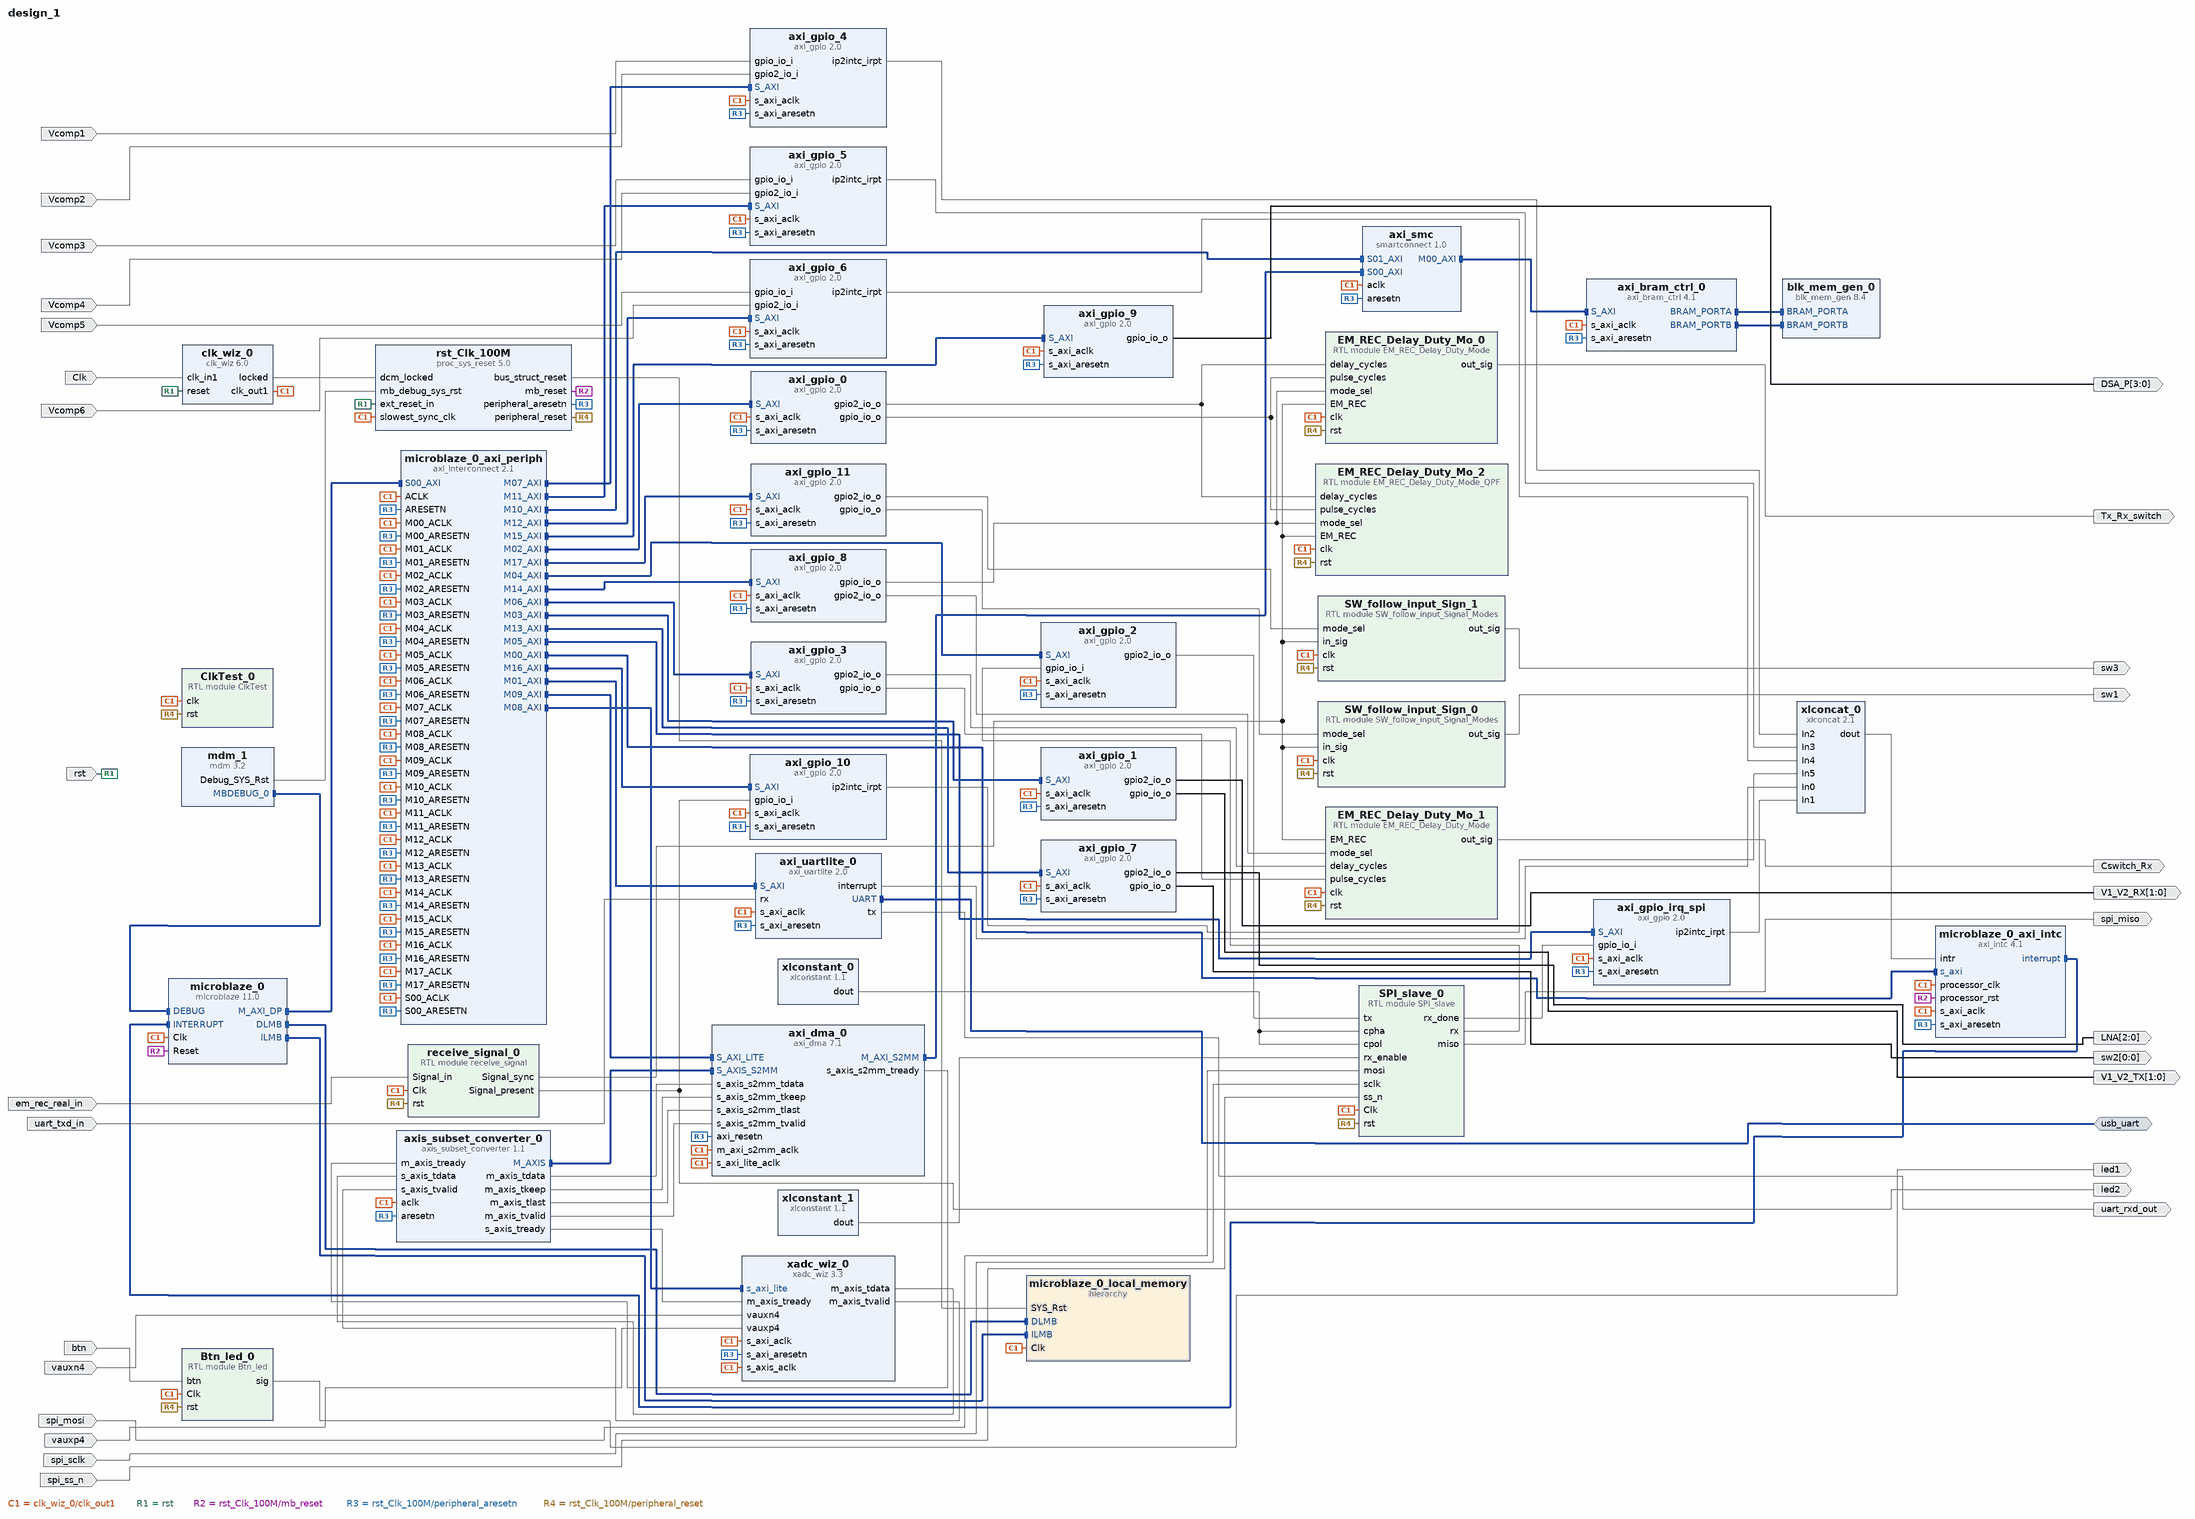
[diagram p0: block diagram of the top level]
# Vivado block design design_1, xc7a35tcpg236-1, Vivado 2025.1
create_bd_design design_1

create_bd_intf_port -mode Master -vlnv xilinx.com:interface:uart_rtl:1.0 usb_uart
create_bd_port -dir I -type clk Clk
set_property -dict {CONFIG.FREQ_HZ 12000000} [get_bd_ports Clk]
create_bd_port -dir I -type rst rst
set_property -dict {CONFIG.POLARITY ACTIVE_HIGH} [get_bd_ports rst]
create_bd_port -dir I uart_txd_in
create_bd_port -dir O uart_rxd_out
create_bd_port -dir O led1
create_bd_port -dir I spi_sclk
create_bd_port -dir I spi_mosi
create_bd_port -dir O spi_miso
create_bd_port -dir I spi_ss_n
create_bd_port -dir O Tx_Rx_switch
create_bd_port -dir O Cswitch_Rx
create_bd_port -dir I em_rec_real_in
create_bd_port -dir O -from 1 -to 0 V1_V2_TX
create_bd_port -dir I Vcomp1
create_bd_port -dir I Vcomp2
create_bd_port -dir I vauxn4
create_bd_port -dir I vauxp4
create_bd_port -dir I Vcomp3
create_bd_port -dir I Vcomp4
create_bd_port -dir I Vcomp5
create_bd_port -dir I Vcomp6
create_bd_port -dir I btn
create_bd_port -dir O -from 1 -to 0 V1_V2_RX
create_bd_port -dir O -from 2 -to 0 LNA
create_bd_port -dir O -from 3 -to 0 DSA_P
create_bd_port -dir O led2
create_bd_port -dir O sw1
create_bd_port -dir O sw3
create_bd_port -dir O -from 0 -to 0 sw2

create_bd_cell -type ip -vlnv xilinx.com:ip:microblaze:11.0 microblaze_0
set_property -dict [list \
  CONFIG.C_DEBUG_ENABLED 1 \
  CONFIG.C_D_AXI 1 \
  CONFIG.C_D_LMB 1 \
  CONFIG.C_ENABLE_CONVERSION 0 \
  CONFIG.C_I_LMB 1 \
] [get_bd_cells microblaze_0]
create_bd_cell -type hier microblaze_0_local_memory
create_bd_cell -type ip -vlnv xilinx.com:ip:axi_interconnect:2.1 microblaze_0_axi_periph
set_property -dict {CONFIG.NUM_MI 18} [get_bd_cells microblaze_0_axi_periph]
create_bd_cell -type ip -vlnv xilinx.com:ip:axi_intc:4.1 microblaze_0_axi_intc
set_property -dict {CONFIG.C_HAS_FAST 1} [get_bd_cells microblaze_0_axi_intc]
create_bd_cell -type ip -vlnv xilinx.com:ip:mdm:3.2 mdm_1
create_bd_cell -type ip -vlnv xilinx.com:ip:proc_sys_reset:5.0 rst_Clk_100M
set_property -dict {CONFIG.RESET_BOARD_INTERFACE reset CONFIG.USE_BOARD_FLOW true} [get_bd_cells rst_Clk_100M]
create_bd_cell -type ip -vlnv xilinx.com:ip:axi_uartlite:2.0 axi_uartlite_0
set_property -dict [list \
  CONFIG.C_BAUDRATE 115200 \
  CONFIG.UARTLITE_BOARD_INTERFACE usb_uart \
  CONFIG.USE_BOARD_FLOW true \
] [get_bd_cells axi_uartlite_0]
create_bd_cell -type ip -vlnv xilinx.com:ip:axi_gpio:2.0 axi_gpio_0
set_property -dict [list \
  CONFIG.C_ALL_OUTPUTS 1 \
  CONFIG.C_ALL_OUTPUTS_2 1 \
  CONFIG.C_GPIO2_WIDTH 16 \
  CONFIG.C_GPIO_WIDTH 16 \
  CONFIG.C_IS_DUAL 1 \
] [get_bd_cells axi_gpio_0]
create_bd_cell -type ip -vlnv xilinx.com:ip:axi_gpio:2.0 axi_gpio_1
set_property -dict [list \
  CONFIG.C_ALL_OUTPUTS 1 \
  CONFIG.C_ALL_OUTPUTS_2 1 \
  CONFIG.C_GPIO2_WIDTH 2 \
  CONFIG.C_GPIO_WIDTH 2 \
  CONFIG.C_IS_DUAL 1 \
] [get_bd_cells axi_gpio_1]
create_bd_cell -type module -reference SPI_slave SPI_slave_0
create_bd_cell -type ip -vlnv xilinx.com:ip:xlconstant:1.1 xlconstant_0
set_property -dict {CONFIG.CONST_VAL 0} [get_bd_cells xlconstant_0]
create_bd_cell -type ip -vlnv xilinx.com:ip:xlconstant:1.1 xlconstant_1
create_bd_cell -type ip -vlnv xilinx.com:ip:axi_gpio:2.0 axi_gpio_2
set_property -dict [list \
  CONFIG.C_ALL_INPUTS 1 \
  CONFIG.C_ALL_OUTPUTS_2 1 \
  CONFIG.C_GPIO2_WIDTH 16 \
  CONFIG.C_GPIO_WIDTH 16 \
  CONFIG.C_IS_DUAL 1 \
] [get_bd_cells axi_gpio_2]
create_bd_cell -type ip -vlnv xilinx.com:ip:axi_gpio:2.0 axi_gpio_irq_spi
set_property -dict {CONFIG.C_ALL_INPUTS 1 CONFIG.C_GPIO_WIDTH 1 CONFIG.C_INTERRUPT_PRESENT 1} [get_bd_cells axi_gpio_irq_spi]
create_bd_cell -type ip -vlnv xilinx.com:ip:clk_wiz:6.0 clk_wiz_0
create_bd_cell -type module -reference ClkTest ClkTest_0
create_bd_cell -type module -reference receive_signal receive_signal_0
create_bd_cell -type ip -vlnv xilinx.com:ip:axi_gpio:2.0 axi_gpio_3
set_property -dict [list \
  CONFIG.C_ALL_OUTPUTS 1 \
  CONFIG.C_ALL_OUTPUTS_2 1 \
  CONFIG.C_GPIO2_WIDTH 16 \
  CONFIG.C_GPIO_WIDTH 16 \
  CONFIG.C_IS_DUAL 1 \
] [get_bd_cells axi_gpio_3]
create_bd_cell -type ip -vlnv xilinx.com:ip:axi_gpio:2.0 axi_gpio_4
set_property -dict [list \
  CONFIG.C_ALL_INPUTS 1 \
  CONFIG.C_ALL_INPUTS_2 1 \
  CONFIG.C_GPIO2_WIDTH 1 \
  CONFIG.C_GPIO_WIDTH 1 \
  CONFIG.C_INTERRUPT_PRESENT 1 \
  CONFIG.C_IS_DUAL 1 \
] [get_bd_cells axi_gpio_4]
create_bd_cell -type ip -vlnv xilinx.com:ip:xlconcat:2.1 xlconcat_0
set_property -dict {CONFIG.NUM_PORTS 6} [get_bd_cells xlconcat_0]
create_bd_cell -type ip -vlnv xilinx.com:ip:xadc_wiz:3.3 xadc_wiz_0
set_property -dict [list \
  CONFIG.ACQUISITION_TIME 10 \
  CONFIG.CHANNEL_ENABLE_VAUXP4_VAUXN4 false \
  CONFIG.CHANNEL_ENABLE_VP_VN false \
  CONFIG.ENABLE_AXI4STREAM true \
  CONFIG.EXTERNAL_MUX_CHANNEL VP_VN \
  CONFIG.SEQUENCER_MODE Off \
  CONFIG.SINGLE_CHANNEL_ACQUISITION_TIME false \
  CONFIG.SINGLE_CHANNEL_SELECTION VAUXP4_VAUXN4 \
  CONFIG.XADC_STARUP_SELECTION single_channel \
] [get_bd_cells xadc_wiz_0]
create_bd_cell -type ip -vlnv xilinx.com:ip:axi_dma:7.1 axi_dma_0
set_property -dict [list \
  CONFIG.c_include_mm2s 0 \
  CONFIG.c_include_sg 0 \
  CONFIG.c_s_axis_s2mm_tdata_width 32 \
  CONFIG.c_sg_length_width 16 \
] [get_bd_cells axi_dma_0]
create_bd_cell -type ip -vlnv xilinx.com:ip:blk_mem_gen:8.4 blk_mem_gen_0
set_property -dict {CONFIG.Memory_Type True_Dual_Port_RAM} [get_bd_cells blk_mem_gen_0]
create_bd_cell -type ip -vlnv xilinx.com:ip:axi_bram_ctrl:4.1 axi_bram_ctrl_0
create_bd_cell -type ip -vlnv xilinx.com:ip:axis_subset_converter:1.1 axis_subset_converter_0
set_property -dict [list \
  CONFIG.DEFAULT_TLAST 256 \
  CONFIG.M_HAS_TKEEP 1 \
  CONFIG.M_HAS_TLAST 1 \
  CONFIG.M_TDATA_NUM_BYTES 4 \
  CONFIG.S_HAS_TKEEP 0 \
  CONFIG.S_TDATA_NUM_BYTES 2 \
] [get_bd_cells axis_subset_converter_0]
create_bd_cell -type ip -vlnv xilinx.com:ip:smartconnect:1.0 axi_smc
set_property -dict {CONFIG.NUM_SI 2} [get_bd_cells axi_smc]
create_bd_cell -type ip -vlnv xilinx.com:ip:axi_gpio:2.0 axi_gpio_5
set_property -dict [list \
  CONFIG.C_ALL_INPUTS 1 \
  CONFIG.C_ALL_INPUTS_2 1 \
  CONFIG.C_GPIO2_WIDTH 1 \
  CONFIG.C_GPIO_WIDTH 1 \
  CONFIG.C_INTERRUPT_PRESENT 1 \
  CONFIG.C_IS_DUAL 1 \
] [get_bd_cells axi_gpio_5]
create_bd_cell -type ip -vlnv xilinx.com:ip:axi_gpio:2.0 axi_gpio_6
set_property -dict [list \
  CONFIG.C_ALL_INPUTS 1 \
  CONFIG.C_ALL_INPUTS_2 1 \
  CONFIG.C_GPIO2_WIDTH 1 \
  CONFIG.C_GPIO_WIDTH 1 \
  CONFIG.C_INTERRUPT_PRESENT 1 \
  CONFIG.C_IS_DUAL 1 \
] [get_bd_cells axi_gpio_6]
create_bd_cell -type module -reference Btn_led Btn_led_0
create_bd_cell -type ip -vlnv xilinx.com:ip:axi_gpio:2.0 axi_gpio_7
set_property -dict [list \
  CONFIG.C_ALL_OUTPUTS 1 \
  CONFIG.C_ALL_OUTPUTS_2 1 \
  CONFIG.C_GPIO2_WIDTH 3 \
  CONFIG.C_GPIO_WIDTH 1 \
  CONFIG.C_IS_DUAL 1 \
] [get_bd_cells axi_gpio_7]
create_bd_cell -type module -reference EM_REC_Delay_Duty_Mode EM_REC_Delay_Duty_Mo_0
create_bd_cell -type module -reference EM_REC_Delay_Duty_Mode EM_REC_Delay_Duty_Mo_1
create_bd_cell -type ip -vlnv xilinx.com:ip:axi_gpio:2.0 axi_gpio_8
set_property -dict [list \
  CONFIG.C_ALL_OUTPUTS 1 \
  CONFIG.C_ALL_OUTPUTS_2 1 \
  CONFIG.C_GPIO2_WIDTH 2 \
  CONFIG.C_GPIO_WIDTH 2 \
  CONFIG.C_IS_DUAL 1 \
] [get_bd_cells axi_gpio_8]
create_bd_cell -type ip -vlnv xilinx.com:ip:axi_gpio:2.0 axi_gpio_9
set_property -dict {CONFIG.C_ALL_OUTPUTS 1 CONFIG.C_GPIO_WIDTH 4 CONFIG.C_IS_DUAL 0} [get_bd_cells axi_gpio_9]
create_bd_cell -type ip -vlnv xilinx.com:ip:axi_gpio:2.0 axi_gpio_10
set_property -dict {CONFIG.C_ALL_INPUTS 1 CONFIG.C_GPIO_WIDTH 1 CONFIG.C_INTERRUPT_PRESENT 1} [get_bd_cells axi_gpio_10]
create_bd_cell -type module -reference EM_REC_Delay_Duty_Mode_QPF EM_REC_Delay_Duty_Mo_2
create_bd_cell -type ip -vlnv xilinx.com:ip:axi_gpio:2.0 axi_gpio_11
set_property -dict [list \
  CONFIG.C_ALL_OUTPUTS 1 \
  CONFIG.C_ALL_OUTPUTS_2 1 \
  CONFIG.C_GPIO2_WIDTH 2 \
  CONFIG.C_GPIO_WIDTH 2 \
  CONFIG.C_IS_DUAL 1 \
] [get_bd_cells axi_gpio_11]
create_bd_cell -type module -reference SW_follow_input_Signal_Modes SW_follow_input_Sign_0
create_bd_cell -type module -reference SW_follow_input_Signal_Modes SW_follow_input_Sign_1

# ---- hierarchy /microblaze_0_local_memory ----
current_bd_instance /microblaze_0_local_memory
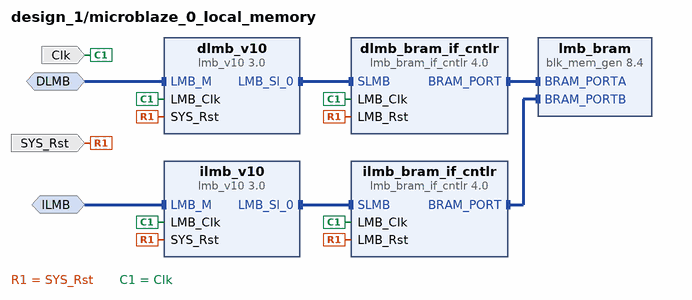
[diagram p1: block diagram inside /microblaze_0_local_memory]
create_bd_intf_pin -mode MirroredMaster -vlnv xilinx.com:interface:lmb_rtl:1.0 DLMB
create_bd_intf_pin -mode MirroredMaster -vlnv xilinx.com:interface:lmb_rtl:1.0 ILMB
create_bd_pin -dir I -type clk Clk
create_bd_pin -dir I -type rst SYS_Rst

create_bd_cell -type ip -vlnv xilinx.com:ip:lmb_v10:3.0 dlmb_v10
create_bd_cell -type ip -vlnv xilinx.com:ip:lmb_v10:3.0 ilmb_v10
create_bd_cell -type ip -vlnv xilinx.com:ip:lmb_bram_if_cntlr:4.0 dlmb_bram_if_cntlr
set_property -dict {CONFIG.C_ECC 0} [get_bd_cells dlmb_bram_if_cntlr]
create_bd_cell -type ip -vlnv xilinx.com:ip:lmb_bram_if_cntlr:4.0 ilmb_bram_if_cntlr
set_property -dict {CONFIG.C_ECC 0} [get_bd_cells ilmb_bram_if_cntlr]
create_bd_cell -type ip -vlnv xilinx.com:ip:blk_mem_gen:8.4 lmb_bram
set_property -dict {CONFIG.Memory_Type True_Dual_Port_RAM CONFIG.use_bram_block BRAM_Controller} [get_bd_cells lmb_bram]

# ---- connections ----

current_bd_instance /microblaze_0_local_memory
connect_bd_intf_net -intf_net microblaze_0_dlmb [get_bd_intf_pins dlmb_v10/LMB_M] [get_bd_intf_pins DLMB]
connect_bd_intf_net -intf_net microblaze_0_dlmb_bus [get_bd_intf_pins dlmb_v10/LMB_Sl_0] [get_bd_intf_pins dlmb_bram_if_cntlr/SLMB]
connect_bd_intf_net -intf_net microblaze_0_dlmb_cntlr [get_bd_intf_pins dlmb_bram_if_cntlr/BRAM_PORT] [get_bd_intf_pins lmb_bram/BRAM_PORTA]
connect_bd_intf_net -intf_net microblaze_0_ilmb [get_bd_intf_pins ilmb_v10/LMB_M] [get_bd_intf_pins ILMB]
connect_bd_intf_net -intf_net microblaze_0_ilmb_bus [get_bd_intf_pins ilmb_v10/LMB_Sl_0] [get_bd_intf_pins ilmb_bram_if_cntlr/SLMB]
connect_bd_intf_net -intf_net microblaze_0_ilmb_cntlr [get_bd_intf_pins ilmb_bram_if_cntlr/BRAM_PORT] [get_bd_intf_pins lmb_bram/BRAM_PORTB]
connect_bd_net [get_bd_pins SYS_Rst] \
  [get_bd_pins dlmb_v10/SYS_Rst] [get_bd_pins dlmb_bram_if_cntlr/LMB_Rst] [get_bd_pins ilmb_v10/SYS_Rst] \
  [get_bd_pins ilmb_bram_if_cntlr/LMB_Rst]
connect_bd_net -net microblaze_0_Clk [get_bd_pins Clk] \
  [get_bd_pins dlmb_v10/LMB_Clk] [get_bd_pins dlmb_bram_if_cntlr/LMB_Clk] [get_bd_pins ilmb_v10/LMB_Clk] \
  [get_bd_pins ilmb_bram_if_cntlr/LMB_Clk]
set_property HDL_ATTRIBUTE.BMM_INFO_ADDRESS_SPACE {byte  0x00000000 32 > design_1 microblaze_0_local_memory/lmb_bram} [get_bd_cells dlmb_bram_if_cntlr]
set_property HDL_ATTRIBUTE.KEEP_HIERARCHY yes [get_bd_cells dlmb_bram_if_cntlr]

current_bd_instance /
connect_bd_intf_net [get_bd_intf_pins axi_bram_ctrl_0/BRAM_PORTA] [get_bd_intf_pins blk_mem_gen_0/BRAM_PORTA]
connect_bd_intf_net [get_bd_intf_pins blk_mem_gen_0/BRAM_PORTB] [get_bd_intf_pins axi_bram_ctrl_0/BRAM_PORTB]
connect_bd_intf_net [get_bd_intf_pins axi_dma_0/M_AXI_S2MM] [get_bd_intf_pins axi_smc/S00_AXI]
connect_bd_intf_net [get_bd_intf_pins axi_smc/M00_AXI] [get_bd_intf_pins axi_bram_ctrl_0/S_AXI]
connect_bd_intf_net [get_bd_intf_ports usb_uart] [get_bd_intf_pins axi_uartlite_0/UART]
connect_bd_intf_net [get_bd_intf_pins axis_subset_converter_0/M_AXIS] [get_bd_intf_pins axi_dma_0/S_AXIS_S2MM]
connect_bd_intf_net -intf_net microblaze_0_axi_dp [get_bd_intf_pins microblaze_0_axi_periph/S00_AXI] [get_bd_intf_pins microblaze_0/M_AXI_DP]
connect_bd_intf_net [get_bd_intf_pins microblaze_0_axi_periph/M01_AXI] [get_bd_intf_pins axi_uartlite_0/S_AXI]
connect_bd_intf_net [get_bd_intf_pins microblaze_0_axi_periph/M02_AXI] [get_bd_intf_pins axi_gpio_0/S_AXI]
connect_bd_intf_net [get_bd_intf_pins microblaze_0_axi_periph/M03_AXI] [get_bd_intf_pins axi_gpio_1/S_AXI]
connect_bd_intf_net [get_bd_intf_pins microblaze_0_axi_periph/M04_AXI] [get_bd_intf_pins axi_gpio_2/S_AXI]
connect_bd_intf_net [get_bd_intf_pins microblaze_0_axi_periph/M05_AXI] [get_bd_intf_pins axi_gpio_irq_spi/S_AXI]
connect_bd_intf_net [get_bd_intf_pins microblaze_0_axi_periph/M06_AXI] [get_bd_intf_pins axi_gpio_3/S_AXI]
connect_bd_intf_net [get_bd_intf_pins microblaze_0_axi_periph/M07_AXI] [get_bd_intf_pins axi_gpio_4/S_AXI]
connect_bd_intf_net [get_bd_intf_pins microblaze_0_axi_periph/M08_AXI] [get_bd_intf_pins xadc_wiz_0/s_axi_lite]
connect_bd_intf_net [get_bd_intf_pins microblaze_0_axi_periph/M09_AXI] [get_bd_intf_pins axi_dma_0/S_AXI_LITE]
connect_bd_intf_net [get_bd_intf_pins microblaze_0_axi_periph/M10_AXI] [get_bd_intf_pins axi_smc/S01_AXI]
connect_bd_intf_net [get_bd_intf_pins microblaze_0_axi_periph/M11_AXI] [get_bd_intf_pins axi_gpio_5/S_AXI]
connect_bd_intf_net [get_bd_intf_pins microblaze_0_axi_periph/M12_AXI] [get_bd_intf_pins axi_gpio_6/S_AXI]
connect_bd_intf_net [get_bd_intf_pins microblaze_0_axi_periph/M13_AXI] [get_bd_intf_pins axi_gpio_7/S_AXI]
connect_bd_intf_net [get_bd_intf_pins microblaze_0_axi_periph/M14_AXI] [get_bd_intf_pins axi_gpio_8/S_AXI]
connect_bd_intf_net [get_bd_intf_pins microblaze_0_axi_periph/M15_AXI] [get_bd_intf_pins axi_gpio_9/S_AXI]
connect_bd_intf_net [get_bd_intf_pins microblaze_0_axi_periph/M16_AXI] [get_bd_intf_pins axi_gpio_10/S_AXI]
connect_bd_intf_net [get_bd_intf_pins microblaze_0_axi_periph/M17_AXI] [get_bd_intf_pins axi_gpio_11/S_AXI]
connect_bd_intf_net [get_bd_intf_pins mdm_1/MBDEBUG_0] [get_bd_intf_pins microblaze_0/DEBUG]
connect_bd_intf_net [get_bd_intf_pins microblaze_0/DLMB] [get_bd_intf_pins microblaze_0_local_memory/DLMB]
connect_bd_intf_net [get_bd_intf_pins microblaze_0/ILMB] [get_bd_intf_pins microblaze_0_local_memory/ILMB]
connect_bd_intf_net -intf_net microblaze_0_intc_axi [get_bd_intf_pins microblaze_0_axi_periph/M00_AXI] [get_bd_intf_pins microblaze_0_axi_intc/s_axi]
connect_bd_intf_net [get_bd_intf_pins microblaze_0_axi_intc/interrupt] [get_bd_intf_pins microblaze_0/INTERRUPT]
connect_bd_net [get_bd_pins Btn_led_0/sig] [get_bd_ports led1]
connect_bd_net [get_bd_ports Clk] [get_bd_pins clk_wiz_0/clk_in1]
connect_bd_net [get_bd_pins EM_REC_Delay_Duty_Mo_0/out_sig] [get_bd_ports Tx_Rx_switch]
connect_bd_net [get_bd_pins EM_REC_Delay_Duty_Mo_1/out_sig] [get_bd_ports Cswitch_Rx]
connect_bd_net [get_bd_pins SPI_slave_0/miso] [get_bd_ports spi_miso]
connect_bd_net [get_bd_pins SPI_slave_0/rx] [get_bd_pins axi_gpio_2/gpio_io_i]
connect_bd_net [get_bd_pins SPI_slave_0/rx_done] [get_bd_pins axi_gpio_irq_spi/gpio_io_i]
connect_bd_net [get_bd_pins SW_follow_input_Sign_0/out_sig] [get_bd_ports sw1]
connect_bd_net [get_bd_pins SW_follow_input_Sign_1/out_sig] [get_bd_ports sw3]
connect_bd_net -net Vcomp1_1 [get_bd_ports Vcomp1] [get_bd_pins axi_gpio_4/gpio_io_i]
connect_bd_net -net Vcomp2_1 [get_bd_ports Vcomp2] [get_bd_pins axi_gpio_4/gpio2_io_i]
connect_bd_net -net Vcomp3_1 [get_bd_ports Vcomp3] [get_bd_pins axi_gpio_5/gpio_io_i]
connect_bd_net -net Vcomp4_1 [get_bd_ports Vcomp4] [get_bd_pins axi_gpio_5/gpio2_io_i]
connect_bd_net -net Vcomp5_1 [get_bd_ports Vcomp5] [get_bd_pins axi_gpio_6/gpio_io_i]
connect_bd_net -net Vcomp6_1 [get_bd_ports Vcomp6] [get_bd_pins axi_gpio_6/gpio2_io_i]
connect_bd_net [get_bd_pins axi_dma_0/s_axis_s2mm_tready] [get_bd_pins axis_subset_converter_0/m_axis_tready]
connect_bd_net [get_bd_pins axi_gpio_0/gpio2_io_o] [get_bd_pins EM_REC_Delay_Duty_Mo_0/delay_cycles] [get_bd_pins EM_REC_Delay_Duty_Mo_2/delay_cycles]
connect_bd_net [get_bd_pins axi_gpio_0/gpio_io_o] [get_bd_pins EM_REC_Delay_Duty_Mo_0/pulse_cycles] [get_bd_pins EM_REC_Delay_Duty_Mo_2/pulse_cycles]
connect_bd_net [get_bd_pins axi_gpio_10/ip2intc_irpt] [get_bd_pins xlconcat_0/In5]
connect_bd_net [get_bd_pins axi_gpio_11/gpio2_io_o] [get_bd_pins SW_follow_input_Sign_1/mode_sel]
connect_bd_net [get_bd_pins axi_gpio_11/gpio_io_o] [get_bd_pins SW_follow_input_Sign_0/mode_sel]
connect_bd_net [get_bd_pins axi_gpio_1/gpio2_io_o] [get_bd_ports V1_V2_RX]
connect_bd_net [get_bd_pins axi_gpio_1/gpio_io_o] [get_bd_ports V1_V2_TX]
connect_bd_net [get_bd_pins axi_gpio_2/gpio2_io_o] [get_bd_pins SPI_slave_0/tx]
connect_bd_net [get_bd_pins axi_gpio_3/gpio2_io_o] [get_bd_pins EM_REC_Delay_Duty_Mo_1/delay_cycles]
connect_bd_net [get_bd_pins axi_gpio_3/gpio_io_o] [get_bd_pins EM_REC_Delay_Duty_Mo_1/pulse_cycles]
connect_bd_net [get_bd_pins axi_gpio_4/ip2intc_irpt] [get_bd_pins xlconcat_0/In2]
connect_bd_net [get_bd_pins axi_gpio_5/ip2intc_irpt] [get_bd_pins xlconcat_0/In3]
connect_bd_net [get_bd_pins axi_gpio_6/ip2intc_irpt] [get_bd_pins xlconcat_0/In4]
connect_bd_net [get_bd_pins axi_gpio_7/gpio2_io_o] [get_bd_ports LNA]
connect_bd_net [get_bd_pins axi_gpio_7/gpio_io_o] [get_bd_ports sw2]
connect_bd_net [get_bd_pins axi_gpio_8/gpio2_io_o] [get_bd_pins EM_REC_Delay_Duty_Mo_1/mode_sel]
connect_bd_net [get_bd_pins axi_gpio_8/gpio_io_o] [get_bd_pins EM_REC_Delay_Duty_Mo_0/mode_sel] [get_bd_pins EM_REC_Delay_Duty_Mo_2/mode_sel]
connect_bd_net [get_bd_pins axi_gpio_9/gpio_io_o] [get_bd_ports DSA_P]
connect_bd_net [get_bd_pins axi_gpio_irq_spi/ip2intc_irpt] [get_bd_pins xlconcat_0/In1]
connect_bd_net [get_bd_pins axi_uartlite_0/interrupt] [get_bd_pins xlconcat_0/In0]
connect_bd_net [get_bd_pins axi_uartlite_0/tx] [get_bd_ports uart_rxd_out]
connect_bd_net [get_bd_pins axis_subset_converter_0/m_axis_tdata] [get_bd_pins axi_dma_0/s_axis_s2mm_tdata]
connect_bd_net [get_bd_pins axis_subset_converter_0/m_axis_tkeep] [get_bd_pins axi_dma_0/s_axis_s2mm_tkeep]
connect_bd_net [get_bd_pins axis_subset_converter_0/m_axis_tlast] [get_bd_pins axi_dma_0/s_axis_s2mm_tlast]
connect_bd_net [get_bd_pins axis_subset_converter_0/m_axis_tvalid] [get_bd_pins axi_dma_0/s_axis_s2mm_tvalid]
connect_bd_net [get_bd_pins axis_subset_converter_0/s_axis_tready] [get_bd_pins xadc_wiz_0/m_axis_tready]
connect_bd_net [get_bd_ports btn] [get_bd_pins Btn_led_0/btn]
connect_bd_net [get_bd_pins clk_wiz_0/clk_out1] \
  [get_bd_pins axi_gpio_0/s_axi_aclk] [get_bd_pins microblaze_0_axi_periph/M02_ACLK] [get_bd_pins axi_gpio_1/s_axi_aclk] \
  [get_bd_pins microblaze_0_axi_periph/M03_ACLK] [get_bd_pins axi_gpio_2/s_axi_aclk] \
  [get_bd_pins microblaze_0_axi_periph/M04_ACLK] [get_bd_pins axi_gpio_irq_spi/s_axi_aclk] \
  [get_bd_pins microblaze_0_axi_periph/M05_ACLK] [get_bd_pins axi_uartlite_0/s_axi_aclk] \
  [get_bd_pins microblaze_0_axi_periph/M01_ACLK] [get_bd_pins microblaze_0/Clk] [get_bd_pins microblaze_0_local_memory/Clk] \
  [get_bd_pins microblaze_0_axi_periph/S00_ACLK] [get_bd_pins microblaze_0_axi_intc/processor_clk] \
  [get_bd_pins microblaze_0_axi_intc/s_axi_aclk] [get_bd_pins microblaze_0_axi_periph/M00_ACLK] \
  [get_bd_pins microblaze_0_axi_periph/ACLK] [get_bd_pins rst_Clk_100M/slowest_sync_clk] [get_bd_pins ClkTest_0/clk] \
  [get_bd_pins axi_gpio_3/s_axi_aclk] [get_bd_pins microblaze_0_axi_periph/M06_ACLK] [get_bd_pins axi_gpio_4/s_axi_aclk] \
  [get_bd_pins microblaze_0_axi_periph/M07_ACLK] [get_bd_pins xadc_wiz_0/s_axi_aclk] \
  [get_bd_pins microblaze_0_axi_periph/M08_ACLK] [get_bd_pins axi_bram_ctrl_0/s_axi_aclk] \
  [get_bd_pins axi_dma_0/m_axi_s2mm_aclk] [get_bd_pins axi_dma_0/s_axi_lite_aclk] \
  [get_bd_pins microblaze_0_axi_periph/M09_ACLK] [get_bd_pins xadc_wiz_0/s_axis_aclk] \
  [get_bd_pins axis_subset_converter_0/aclk] [get_bd_pins axi_smc/aclk] [get_bd_pins microblaze_0_axi_periph/M10_ACLK] \
  [get_bd_pins axi_gpio_5/s_axi_aclk] [get_bd_pins microblaze_0_axi_periph/M11_ACLK] [get_bd_pins axi_gpio_6/s_axi_aclk] \
  [get_bd_pins microblaze_0_axi_periph/M12_ACLK] [get_bd_pins Btn_led_0/Clk] [get_bd_pins axi_gpio_7/s_axi_aclk] \
  [get_bd_pins microblaze_0_axi_periph/M13_ACLK] [get_bd_pins microblaze_0_axi_periph/M14_ACLK] \
  [get_bd_pins microblaze_0_axi_periph/M15_ACLK] [get_bd_pins axi_gpio_8/s_axi_aclk] [get_bd_pins axi_gpio_9/s_axi_aclk] \
  [get_bd_pins axi_gpio_10/s_axi_aclk] [get_bd_pins microblaze_0_axi_periph/M16_ACLK] [get_bd_pins receive_signal_0/Clk] \
  [get_bd_pins EM_REC_Delay_Duty_Mo_0/clk] [get_bd_pins EM_REC_Delay_Duty_Mo_1/clk] [get_bd_pins EM_REC_Delay_Duty_Mo_2/clk] \
  [get_bd_pins axi_gpio_11/s_axi_aclk] [get_bd_pins microblaze_0_axi_periph/M17_ACLK] [get_bd_pins SPI_slave_0/Clk] \
  [get_bd_pins SW_follow_input_Sign_0/clk] [get_bd_pins SW_follow_input_Sign_1/clk]
connect_bd_net [get_bd_pins clk_wiz_0/locked] [get_bd_pins rst_Clk_100M/dcm_locked]
connect_bd_net [get_bd_ports em_rec_real_in] [get_bd_pins receive_signal_0/Signal_in]
connect_bd_net [get_bd_pins mdm_1/Debug_SYS_Rst] [get_bd_pins rst_Clk_100M/mb_debug_sys_rst]
connect_bd_net -net receive_signal_0_Signal_out [get_bd_pins receive_signal_0/Signal_sync] \
  [get_bd_pins EM_REC_Delay_Duty_Mo_0/EM_REC] [get_bd_pins EM_REC_Delay_Duty_Mo_1/EM_REC] \
  [get_bd_pins EM_REC_Delay_Duty_Mo_2/EM_REC] [get_bd_pins SW_follow_input_Sign_0/in_sig] \
  [get_bd_pins SW_follow_input_Sign_1/in_sig]
connect_bd_net [get_bd_pins receive_signal_0/Signal_present] [get_bd_ports led2] [get_bd_pins axi_gpio_10/gpio_io_i]
connect_bd_net [get_bd_ports rst] [get_bd_pins clk_wiz_0/reset] [get_bd_pins rst_Clk_100M/ext_reset_in]
connect_bd_net [get_bd_pins rst_Clk_100M/bus_struct_reset] [get_bd_pins microblaze_0_local_memory/SYS_Rst]
connect_bd_net [get_bd_pins rst_Clk_100M/mb_reset] [get_bd_pins microblaze_0/Reset] [get_bd_pins microblaze_0_axi_intc/processor_rst]
connect_bd_net [get_bd_pins rst_Clk_100M/peripheral_aresetn] \
  [get_bd_pins microblaze_0_axi_intc/s_axi_aresetn] [get_bd_pins microblaze_0_axi_periph/M03_ARESETN] \
  [get_bd_pins microblaze_0_axi_periph/M01_ARESETN] [get_bd_pins microblaze_0_axi_periph/M00_ARESETN] \
  [get_bd_pins microblaze_0_axi_periph/S00_ARESETN] [get_bd_pins microblaze_0_axi_periph/ARESETN] \
  [get_bd_pins axi_uartlite_0/s_axi_aresetn] [get_bd_pins axi_gpio_1/s_axi_aresetn] [get_bd_pins axi_gpio_0/s_axi_aresetn] \
  [get_bd_pins microblaze_0_axi_periph/M02_ARESETN] [get_bd_pins axi_gpio_2/s_axi_aresetn] \
  [get_bd_pins microblaze_0_axi_periph/M04_ARESETN] [get_bd_pins axi_gpio_irq_spi/s_axi_aresetn] \
  [get_bd_pins microblaze_0_axi_periph/M05_ARESETN] [get_bd_pins axi_gpio_3/s_axi_aresetn] \
  [get_bd_pins microblaze_0_axi_periph/M06_ARESETN] [get_bd_pins axi_gpio_4/s_axi_aresetn] \
  [get_bd_pins microblaze_0_axi_periph/M07_ARESETN] [get_bd_pins xadc_wiz_0/s_axi_aresetn] \
  [get_bd_pins microblaze_0_axi_periph/M08_ARESETN] [get_bd_pins axi_bram_ctrl_0/s_axi_aresetn] \
  [get_bd_pins axi_dma_0/axi_resetn] [get_bd_pins microblaze_0_axi_periph/M09_ARESETN] \
  [get_bd_pins axis_subset_converter_0/aresetn] [get_bd_pins axi_smc/aresetn] \
  [get_bd_pins microblaze_0_axi_periph/M10_ARESETN] [get_bd_pins axi_gpio_5/s_axi_aresetn] \
  [get_bd_pins microblaze_0_axi_periph/M11_ARESETN] [get_bd_pins axi_gpio_6/s_axi_aresetn] \
  [get_bd_pins microblaze_0_axi_periph/M12_ARESETN] [get_bd_pins axi_gpio_7/s_axi_aresetn] \
  [get_bd_pins microblaze_0_axi_periph/M13_ARESETN] [get_bd_pins microblaze_0_axi_periph/M14_ARESETN] \
  [get_bd_pins microblaze_0_axi_periph/M15_ARESETN] [get_bd_pins axi_gpio_8/s_axi_aresetn] \
  [get_bd_pins axi_gpio_9/s_axi_aresetn] [get_bd_pins axi_gpio_10/s_axi_aresetn] \
  [get_bd_pins microblaze_0_axi_periph/M16_ARESETN] [get_bd_pins axi_gpio_11/s_axi_aresetn] \
  [get_bd_pins microblaze_0_axi_periph/M17_ARESETN]
connect_bd_net [get_bd_pins rst_Clk_100M/peripheral_reset] \
  [get_bd_pins ClkTest_0/rst] [get_bd_pins Btn_led_0/rst] [get_bd_pins receive_signal_0/rst] \
  [get_bd_pins EM_REC_Delay_Duty_Mo_0/rst] [get_bd_pins EM_REC_Delay_Duty_Mo_1/rst] [get_bd_pins EM_REC_Delay_Duty_Mo_2/rst] \
  [get_bd_pins SPI_slave_0/rst] [get_bd_pins SW_follow_input_Sign_0/rst] [get_bd_pins SW_follow_input_Sign_1/rst]
connect_bd_net [get_bd_ports spi_mosi] [get_bd_pins SPI_slave_0/mosi]
connect_bd_net [get_bd_ports spi_sclk] [get_bd_pins SPI_slave_0/sclk]
connect_bd_net [get_bd_ports spi_ss_n] [get_bd_pins SPI_slave_0/ss_n]
connect_bd_net [get_bd_ports uart_txd_in] [get_bd_pins axi_uartlite_0/rx]
connect_bd_net -net vauxn4_1 [get_bd_ports vauxn4] [get_bd_pins xadc_wiz_0/vauxn4]
connect_bd_net -net vauxp4_1 [get_bd_ports vauxp4] [get_bd_pins xadc_wiz_0/vauxp4]
connect_bd_net [get_bd_pins xadc_wiz_0/m_axis_tdata] [get_bd_pins axis_subset_converter_0/s_axis_tdata]
connect_bd_net [get_bd_pins xadc_wiz_0/m_axis_tvalid] [get_bd_pins axis_subset_converter_0/s_axis_tvalid]
connect_bd_net [get_bd_pins xlconcat_0/dout] [get_bd_pins microblaze_0_axi_intc/intr]
connect_bd_net [get_bd_pins xlconstant_0/dout] [get_bd_pins SPI_slave_0/cpol] [get_bd_pins SPI_slave_0/cpha]
connect_bd_net [get_bd_pins xlconstant_1/dout] [get_bd_pins SPI_slave_0/rx_enable]
set_property HDL_ATTRIBUTE.BMM_INFO_PROCESSOR {microblaze-le > design_1 microblaze_0_local_memory/dlmb_bram_if_cntlr design_1 axi_bram_ctrl_0} [get_bd_cells microblaze_0]
set_property HDL_ATTRIBUTE.KEEP_HIERARCHY yes [get_bd_cells microblaze_0]
set_property HDL_ATTRIBUTE.BMM_INFO_ADDRESS_SPACE {byte  0xC0000000 32 > design_1 blk_mem_gen_0} [get_bd_cells axi_bram_ctrl_0]
set_property HDL_ATTRIBUTE.KEEP_HIERARCHY yes [get_bd_cells axi_bram_ctrl_0]

# ---- address map ----
assign_bd_address -offset 0xC0000000 -range 8K -target_address_space [get_bd_addr_spaces axi_dma_0/Data_S2MM] [get_bd_addr_segs axi_bram_ctrl_0/S_AXI/Mem0]
assign_bd_address -offset 0x00000000 -range 64K -target_address_space [get_bd_addr_spaces microblaze_0/Data] [get_bd_addr_segs microblaze_0_local_memory/dlmb_bram_if_cntlr/SLMB/Mem]
assign_bd_address -offset 0x40000000 -range 64K -target_address_space [get_bd_addr_spaces microblaze_0/Data] [get_bd_addr_segs axi_gpio_0/S_AXI/Reg]
assign_bd_address -offset 0x40010000 -range 64K -target_address_space [get_bd_addr_spaces microblaze_0/Data] [get_bd_addr_segs axi_gpio_1/S_AXI/Reg]
assign_bd_address -offset 0x40020000 -range 64K -target_address_space [get_bd_addr_spaces microblaze_0/Data] [get_bd_addr_segs axi_gpio_2/S_AXI/Reg]
assign_bd_address -offset 0x40030000 -range 64K -target_address_space [get_bd_addr_spaces microblaze_0/Data] [get_bd_addr_segs axi_gpio_irq_spi/S_AXI/Reg]
assign_bd_address -offset 0x40040000 -range 64K -target_address_space [get_bd_addr_spaces microblaze_0/Data] [get_bd_addr_segs axi_gpio_3/S_AXI/Reg]
assign_bd_address -offset 0x40050000 -range 64K -target_address_space [get_bd_addr_spaces microblaze_0/Data] [get_bd_addr_segs axi_gpio_4/S_AXI/Reg]
assign_bd_address -offset 0x40060000 -range 64K -target_address_space [get_bd_addr_spaces microblaze_0/Data] [get_bd_addr_segs axi_gpio_5/S_AXI/Reg]
assign_bd_address -offset 0x40070000 -range 64K -target_address_space [get_bd_addr_spaces microblaze_0/Data] [get_bd_addr_segs axi_gpio_6/S_AXI/Reg]
assign_bd_address -offset 0x40080000 -range 64K -target_address_space [get_bd_addr_spaces microblaze_0/Data] [get_bd_addr_segs axi_gpio_7/S_AXI/Reg]
assign_bd_address -offset 0x40090000 -range 64K -target_address_space [get_bd_addr_spaces microblaze_0/Data] [get_bd_addr_segs axi_gpio_8/S_AXI/Reg]
assign_bd_address -offset 0x400A0000 -range 64K -target_address_space [get_bd_addr_spaces microblaze_0/Data] [get_bd_addr_segs axi_gpio_9/S_AXI/Reg]
assign_bd_address -offset 0x400B0000 -range 64K -target_address_space [get_bd_addr_spaces microblaze_0/Data] [get_bd_addr_segs axi_gpio_10/S_AXI/Reg]
assign_bd_address -offset 0x400C0000 -range 64K -target_address_space [get_bd_addr_spaces microblaze_0/Data] [get_bd_addr_segs axi_gpio_11/S_AXI/Reg]
assign_bd_address -offset 0x40600000 -range 64K -target_address_space [get_bd_addr_spaces microblaze_0/Data] [get_bd_addr_segs axi_uartlite_0/S_AXI/Reg]
assign_bd_address -offset 0x41200000 -range 64K -target_address_space [get_bd_addr_spaces microblaze_0/Data] [get_bd_addr_segs microblaze_0_axi_intc/S_AXI/Reg]
assign_bd_address -offset 0x41E00000 -range 64K -target_address_space [get_bd_addr_spaces microblaze_0/Data] [get_bd_addr_segs axi_dma_0/S_AXI_LITE/Reg]
assign_bd_address -offset 0x44A00000 -range 64K -target_address_space [get_bd_addr_spaces microblaze_0/Data] [get_bd_addr_segs xadc_wiz_0/s_axi_lite/Reg]
assign_bd_address -offset 0xC0000000 -range 8K -target_address_space [get_bd_addr_spaces microblaze_0/Data] [get_bd_addr_segs axi_bram_ctrl_0/S_AXI/Mem0]
assign_bd_address -offset 0x00000000 -range 64K -target_address_space [get_bd_addr_spaces microblaze_0/Instruction] [get_bd_addr_segs microblaze_0_local_memory/ilmb_bram_if_cntlr/SLMB/Mem]

validate_bd_design
save_bd_design
